# Altium schematic sheet GPIO.SchDoc
size A3; SheetNumber: 8; SheetTotal: 8
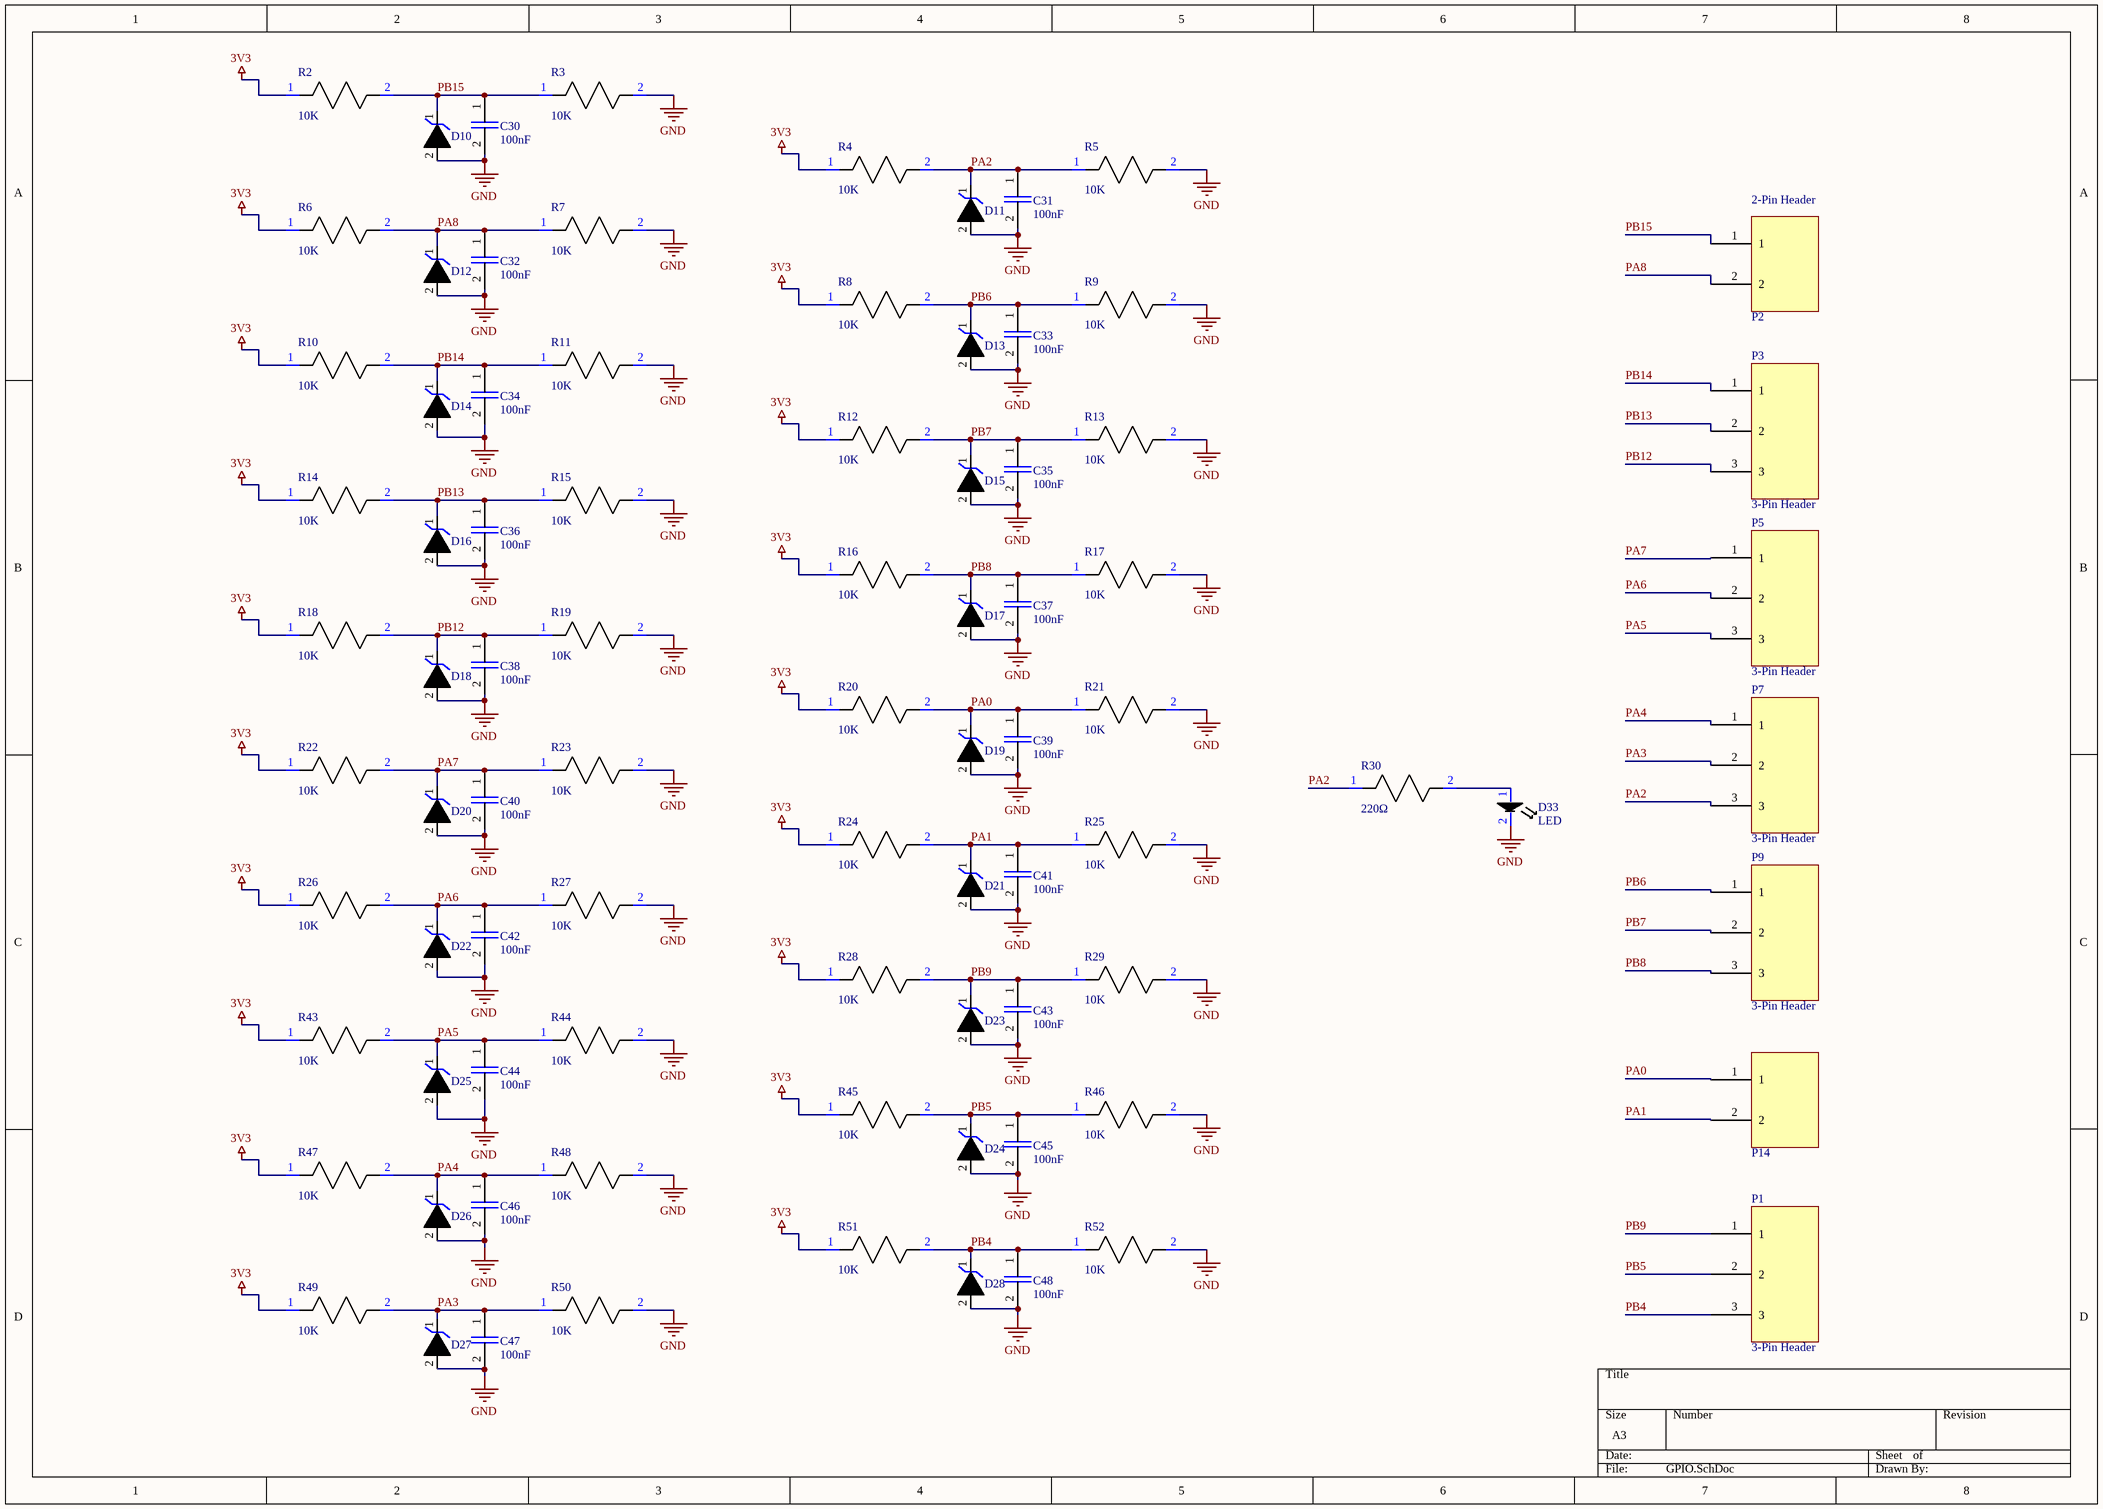
[diagram p0: GPIO.SchDoc]

## Parts
C30  value 100nF  [0603 Cap]  (hidden comment: 0603 Capacitor)
C31  value 100nF  [0603 Cap]  (hidden comment: 0603 Capacitor)
C32  value 100nF  [0603 Cap]  (hidden comment: 0603 Capacitor)
C33  value 100nF  [0603 Cap]  (hidden comment: 0603 Capacitor)
C34  value 100nF  [0603 Cap]  (hidden comment: 0603 Capacitor)
C35  value 100nF  [0603 Cap]  (hidden comment: 0603 Capacitor)
C36  value 100nF  [0603 Cap]  (hidden comment: 0603 Capacitor)
C37  value 100nF  [0603 Cap]  (hidden comment: 0603 Capacitor)
C38  value 100nF  [0603 Cap]  (hidden comment: 0603 Capacitor)
C39  value 100nF  [0603 Cap]  (hidden comment: 0603 Capacitor)
C40  value 100nF  [0603 Cap]  (hidden comment: 0603 Capacitor)
C41  value 100nF  [0603 Cap]  (hidden comment: 0603 Capacitor)
C42  value 100nF  [0603 Cap]  (hidden comment: 0603 Capacitor)
C43  value 100nF  [0603 Cap]  (hidden comment: 0603 Capacitor)
C44  value 100nF  [0603 Cap]  (hidden comment: 0603 Capacitor)
C45  value 100nF  [0603 Cap]  (hidden comment: 0603 Capacitor)
C46  value 100nF  [0603 Cap]  (hidden comment: 0603 Capacitor)
C47  value 100nF  [0603 Cap]  (hidden comment: 0603 Capacitor)
C48  value 100nF  [0603 Cap]  (hidden comment: 0603 Capacitor)
D10  TVS  [TVS DIODE]  (value not drawn)
D11  TVS  [TVS DIODE]  (value not drawn)
D12  TVS  [TVS DIODE]  (value not drawn)
D13  TVS  [TVS DIODE]  (value not drawn)
D14  TVS  [TVS DIODE]  (value not drawn)
D15  TVS  [TVS DIODE]  (value not drawn)
D16  TVS  [TVS DIODE]  (value not drawn)
D17  TVS  [TVS DIODE]  (value not drawn)
D18  TVS  [TVS DIODE]  (value not drawn)
D19  TVS  [TVS DIODE]  (value not drawn)
D20  TVS  [TVS DIODE]  (value not drawn)
D21  TVS  [TVS DIODE]  (value not drawn)
D22  TVS  [TVS DIODE]  (value not drawn)
D23  TVS  [TVS DIODE]  (value not drawn)
D24  TVS  [TVS DIODE]  (value not drawn)
D25  TVS  [TVS DIODE]  (value not drawn)
D26  TVS  [TVS DIODE]  (value not drawn)
D27  TVS  [TVS DIODE]  (value not drawn)
D28  TVS  [TVS DIODE]  (value not drawn)
D33  LED  [0805 LED]
P1  3-Pin Header  [WR-TBL 322 3H]
P2  2-Pin Header  [WR-TBL 322 2H]
P3  3-Pin Header  [WR-TBL 322 3H]
P5  3-Pin Header  [WR-TBL 322 3H]
P7  3-Pin Header  [WR-TBL 322 3H]
P9  3-Pin Header  [WR-TBL 322 3H]
P14  2-Pin Header  [WR-TBL 322 2H]  (value not drawn)
R2  value 10K  [0603 RES]  (hidden comment: Resistor)
R3  value 10K  [0603 RES]  (hidden comment: Resistor)
R4  value 10K  [0603 RES]  (hidden comment: Resistor)
R5  value 10K  [0603 RES]  (hidden comment: Resistor)
R6  value 10K  [0603 RES]  (hidden comment: Resistor)
R7  value 10K  [0603 RES]  (hidden comment: Resistor)
R8  value 10K  [0603 RES]  (hidden comment: Resistor)
R9  value 10K  [0603 RES]  (hidden comment: Resistor)
R10  value 10K  [0603 RES]  (hidden comment: Resistor)
R11  value 10K  [0603 RES]  (hidden comment: Resistor)
R12  value 10K  [0603 RES]  (hidden comment: Resistor)
R13  value 10K  [0603 RES]  (hidden comment: Resistor)
R14  value 10K  [0603 RES]  (hidden comment: Resistor)
R15  value 10K  [0603 RES]  (hidden comment: Resistor)
R16  value 10K  [0603 RES]  (hidden comment: Resistor)
R17  value 10K  [0603 RES]  (hidden comment: Resistor)
R18  value 10K  [0603 RES]  (hidden comment: Resistor)
R19  value 10K  [0603 RES]  (hidden comment: Resistor)
R20  value 10K  [0603 RES]  (hidden comment: Resistor)
R21  value 10K  [0603 RES]  (hidden comment: Resistor)
R22  value 10K  [0603 RES]  (hidden comment: Resistor)
R23  value 10K  [0603 RES]  (hidden comment: Resistor)
R24  value 10K  [0603 RES]  (hidden comment: Resistor)
R25  value 10K  [0603 RES]  (hidden comment: Resistor)
R26  value 10K  [0603 RES]  (hidden comment: Resistor)
R27  value 10K  [0603 RES]  (hidden comment: Resistor)
R28  value 10K  [0603 RES]  (hidden comment: Resistor)
R29  value 10K  [0603 RES]  (hidden comment: Resistor)
R30  value 220Ω  [0603 RES]  (hidden comment: Resistor)
R43  value 10K  [0603 RES]  (hidden comment: Resistor)
R44  value 10K  [0603 RES]  (hidden comment: Resistor)
R45  value 10K  [0603 RES]  (hidden comment: Resistor)
R46  value 10K  [0603 RES]  (hidden comment: Resistor)
R47  value 10K  [0603 RES]  (hidden comment: Resistor)
R48  value 10K  [0603 RES]  (hidden comment: Resistor)
R49  value 10K  [0603 RES]  (hidden comment: Resistor)
R50  value 10K  [0603 RES]  (hidden comment: Resistor)
R51  value 10K  [0603 RES]  (hidden comment: Resistor)
R52  value 10K  [0603 RES]  (hidden comment: Resistor)

## Nets
3V3: R2.1 R4.1 R6.1 R8.1 R10.1 R12.1 R14.1 R16.1 R18.1 R20.1 R22.1 R24.1 R26.1 R28.1 R43.1 R45.1 R47.1 R49.1 R51.1
GND: C30.2 C31.2 C32.2 C33.2 C34.2 C35.2 C36.2 C37.2 C38.2 C39.2 C40.2 C41.2 C42.2 C43.2 C44.2 C45.2 C46.2 C47.2 C48.2 D10.2 D11.2 D12.2 D13.2 D14.2 D15.2 D16.2 D17.2 D18.2 D19.2 D20.2 D21.2 D22.2 D23.2 D24.2 D25.2 D26.2 D27.2 D28.2 D33.2 R3.2 R5.2 R7.2 R9.2 R11.2 R13.2 R15.2 R17.2 R19.2 R21.2 R23.2 R25.2 R27.2 R29.2 R44.2 R46.2 R48.2 R50.2 R52.2
PA0: C39.1 D19.1 P14.1 R20.2 R21.1
PA1: C41.1 D21.1 P14.2 R24.2 R25.1
PA2: C31.1 D11.1 P7.3 R4.2 R5.1 R30.1
PA3: C47.1 D27.1 P7.2 R49.2 R50.1
PA4: C46.1 D26.1 P7.1 R47.2 R48.1
PA5: C44.1 D25.1 P5.3 R43.2 R44.1
PA6: C42.1 D22.1 P5.2 R26.2 R27.1
PA7: C40.1 D20.1 P5.1 R22.2 R23.1
PA8: C32.1 D12.1 P2.2 R6.2 R7.1
PB4: C48.1 D28.1 P1.3 R51.2 R52.1
PB5: C45.1 D24.1 P1.2 R45.2 R46.1
PB6: C33.1 D13.1 P9.1 R8.2 R9.1
PB7: C35.1 D15.1 P9.2 R12.2 R13.1
PB8: C37.1 D17.1 P9.3 R16.2 R17.1
PB9: C43.1 D23.1 P1.1 R28.2 R29.1
PB12: C38.1 D18.1 P3.3 R18.2 R19.1
PB13: C36.1 D16.1 P3.2 R14.2 R15.1
PB14: C34.1 D14.1 P3.1 R10.2 R11.1
PB15: C30.1 D10.1 P2.1 R2.2 R3.1
NetD33_1: D33.1 R30.2

## Library data of the parts
C30-C48 = 0603 Cap: SMD 0603 (ceramic) capacitor; Manufacturer: Murata; Manufacturer Part Number: GRM21BR71C225KA12L; Multilayer: Yes; Tolerance  (fill in as +-): 10%; Rated DC Voltage (URdc): 16V; Temperature Characteristics Code: X7R; Supplier: Mouser; Supplier Part Number: 81-GRM21BR71C225KA2L; RoHS: Yes; Category: Ceramic Capacitors; Stock: 30148; Pricing: 1=0,3, 10=0,163, 50=0,163, 100=0,098, 1000=0,07, 10000=0,054 (USD); Mounting Technology: Surface Mount; Pins: 2; Package Shape: Rectangular; Terminal Finish: Nickel; Dielectric Material: Ceramic; Case/Package: 0805; Min Operating Temperature: -55°C; Max Operating Temperature: 125°C; JESD-609 Code: e3; Package Style: SMTMeter; Capacitor Type: Ceramic; Packaging: Tape and Reel; Tolerance (fill in as +-): 10%; Termination: Wraparound; Length: 2mm; Width: 1.25mm; Height: 1.25mm; Reach SVHC Compliant: Yes; RoHS Compliant: Yes; ComponentLink1URL: https://datasheet.ciiva.com:443/pdfs/VipMasterIC/IC/MURE/MURE-S-A0004349797/MURE-S-A0004361718-1.pdf?src-supplier=IHS+Markit; ComponentLink1Description: https://datasheet.ciiva.com:443/pdfs/VipMasterIC/IC/MURE/MURE-S-A0004349797/MURE-S-A0004361718-1.pdf?src-supplier=IHS+Markit; ComponentLink2URL: https://datasheet.ciiva.com/7937/608985-7937701.pdf?src-supplier=Element14; ComponentLink2Description: https://datasheet.ciiva.com/7937/608985-7937701.pdf?src-supplier=Element14
D10-D28 = TVS Diode: Schematic for TVS diode
P1 P3 P5 P7 P9 = 322-3H: 322 Series 3 pin header
P2 P14 = 322-2H: 322 series 2 pin header
R2-R30 R43-R52 = 0603 Res: Can be used for SMD resistors